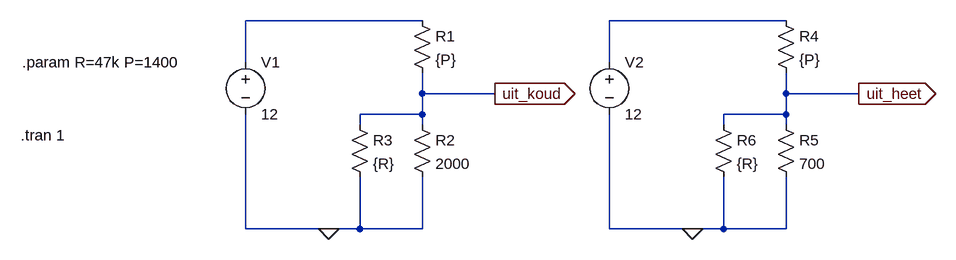
[diagram p0: schematic FanControl.asc]
FanControl.asc, the LTspice schematic file:
Version 4
SHEET 1 988 680
WIRE 160 96 -112 96
WIRE 720 96 448 96
WIRE -112 160 -112 96
WIRE 448 160 448 96
WIRE 160 208 160 176
WIRE 272 208 160 208
WIRE 720 208 720 176
WIRE 832 208 720 208
WIRE 160 240 160 208
WIRE 160 240 64 240
WIRE 720 240 720 208
WIRE 720 240 624 240
WIRE 64 256 64 240
WIRE 160 256 160 240
WIRE 624 256 624 240
WIRE 720 256 720 240
WIRE -112 416 -112 240
WIRE 16 416 -112 416
WIRE 64 416 64 336
WIRE 64 416 16 416
WIRE 160 416 160 336
WIRE 160 416 64 416
WIRE 448 416 448 240
WIRE 576 416 448 416
WIRE 624 416 624 336
WIRE 624 416 576 416
WIRE 720 416 720 336
WIRE 720 416 624 416
FLAG 16 416 0
FLAG 272 208 uit_koud
IOPIN 272 208 Out
FLAG 576 416 0
FLAG 832 208 uit_heet
IOPIN 832 208 Out
SYMBOL res 144 80 R0
SYMATTR InstName R1
SYMATTR Value {P}
SYMATTR SpiceLine tol=5
SYMBOL res 144 240 R0
SYMATTR InstName R2
SYMATTR Value 2000
SYMATTR SpiceLine tol=5
SYMBOL res 48 240 R0
SYMATTR InstName R3
SYMATTR Value {R}
SYMBOL voltage -112 144 R0
WINDOW 123 0 0 Left 0
WINDOW 39 0 0 Left 0
SYMATTR InstName V1
SYMATTR Value 12
SYMBOL res 704 80 R0
SYMATTR InstName R4
SYMATTR Value {P}
SYMATTR SpiceLine tol=5
SYMBOL res 704 240 R0
SYMATTR InstName R5
SYMATTR Value 700
SYMATTR SpiceLine tol=5
SYMBOL res 608 240 R0
SYMATTR InstName R6
SYMATTR Value {R}
SYMBOL voltage 448 144 R0
WINDOW 123 0 0 Left 0
WINDOW 39 0 0 Left 0
SYMATTR InstName V2
SYMATTR Value 12
TEXT -458 272 Left 2 !.tran 1
TEXT -456 160 Left 2 !.param R=47k P=1400

The netlist it stands for:
* FanControl.asc
R1 N001 uit_koud {P} tol=5
R2 uit_koud 0 2000 tol=5
R3 uit_koud 0 {R}
V1 N001 0 12
R4 N002 uit_heet {P} tol=5
R5 uit_heet 0 700 tol=5
R6 uit_heet 0 {R}
V2 N002 0 12
.tran 1
.param R=47k P=1400
.backanno
.end